# Altium project UCLA-DRS4-2.1.PrjPCB (part 6 of 10)

## Sheet CLK_PWR.SchDoc: My title
size A3; Organization: University of California; Address1: 475 Portola Plaza; Address2: Los Angeles, CA 90095; DocumentNumber: 12; Revision: R01; SheetNumber: 12; SheetTotal: 35
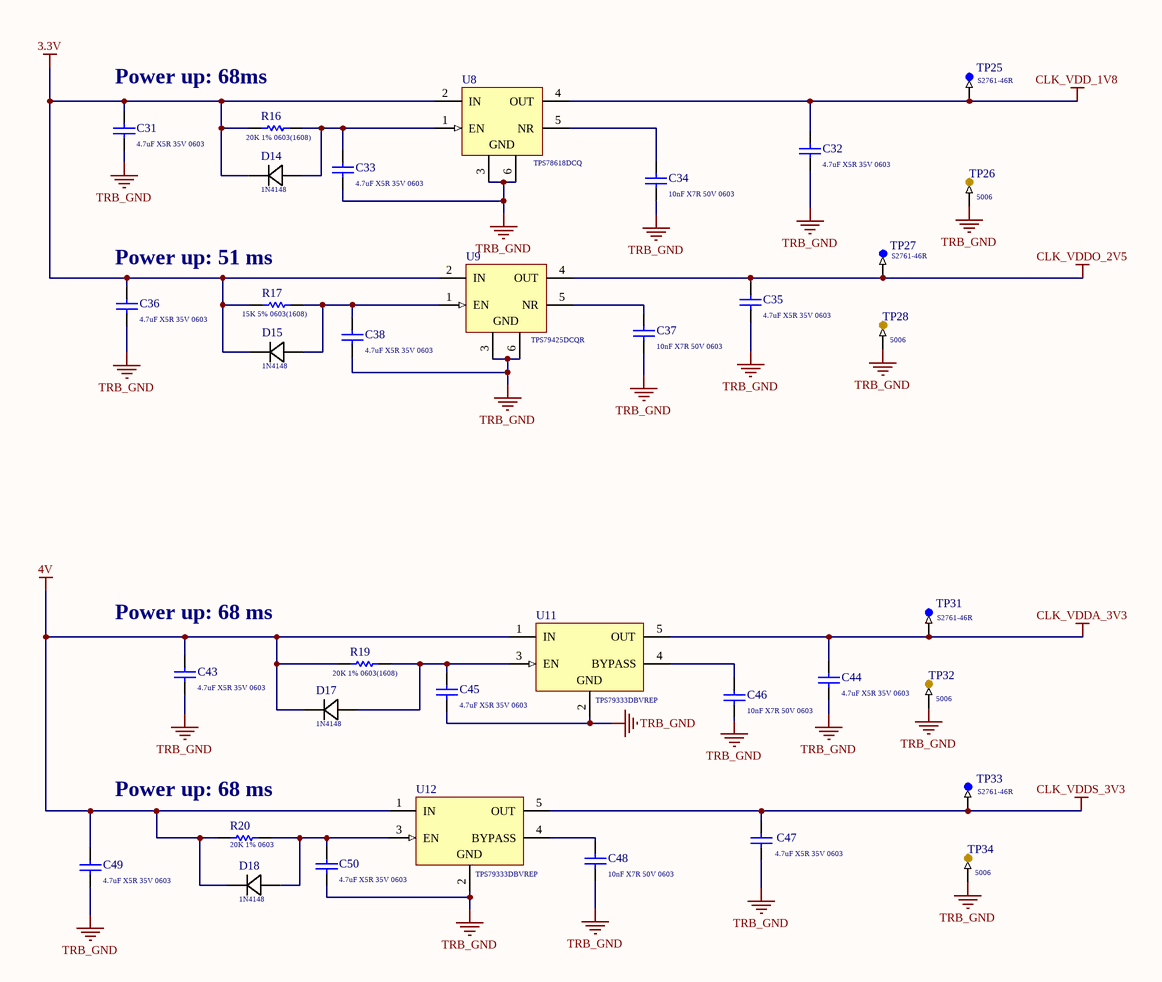
[diagram p14: CLK_PWR.SchDoc]

### Parts
C31  Capacitance: 4.7uF X5R 35V 0603  [Cap_Murata_ZRB18AR6YA475ME05L_4.7uF]  (hidden comment: Cap_Murata_ZRB18AR6YA475ME05L_4.7uF)
C32  Capacitance: 4.7uF X5R 35V 0603  [Cap_Murata_ZRB18AR6YA475ME05L_4.7uF]  (hidden comment: Cap_Murata_ZRB18AR6YA475ME05L_4.7uF)
C33  Capacitance: 4.7uF X5R 35V 0603  [Cap_Murata_ZRB18AR6YA475ME05L_4.7uF]  (hidden comment: Cap_Murata_ZRB18AR6YA475ME05L_4.7uF)
C34  Capacitance: 10nF X7R 50V 0603  [Kemet_C0603_0]  (hidden comment: Cap_Kemet_C0603C103J5RACTU_eec)
C35  Capacitance: 4.7uF X5R 35V 0603  [Cap_Murata_ZRB18AR6YA475ME05L_4.7uF]  (hidden comment: Cap_Murata_ZRB18AR6YA475ME05L_4.7uF)
C36  Capacitance: 4.7uF X5R 35V 0603  [Cap_Murata_ZRB18AR6YA475ME05L_4.7uF]  (hidden comment: Cap_Murata_ZRB18AR6YA475ME05L_4.7uF)
C37  Capacitance: 10nF X7R 50V 0603  [Kemet_C0603_0]  (hidden comment: Cap_Kemet_C0603C103J5RACTU_eec)
C38  Capacitance: 4.7uF X5R 35V 0603  [Cap_Murata_ZRB18AR6YA475ME05L_4.7uF]  (hidden comment: Cap_Murata_ZRB18AR6YA475ME05L_4.7uF)
C43  Capacitance: 4.7uF X5R 35V 0603  [Cap_Murata_ZRB18AR6YA475ME05L_4.7uF]  (hidden comment: Cap_Murata_ZRB18AR6YA475ME05L_4.7uF)
C44  Capacitance: 4.7uF X5R 35V 0603  [Cap_Murata_ZRB18AR6YA475ME05L_4.7uF]  (hidden comment: Cap_Murata_ZRB18AR6YA475ME05L_4.7uF)
C45  Capacitance: 4.7uF X5R 35V 0603  [Cap_Murata_ZRB18AR6YA475ME05L_4.7uF]  (hidden comment: Cap_Murata_ZRB18AR6YA475ME05L_4.7uF)
C46  Capacitance: 10nF X7R 50V 0603  [Kemet_C0603_0]  (hidden comment: Cap_Kemet_C0603C103J5RACTU_eec)
C47  Capacitance: 4.7uF X5R 35V 0603  [Cap_Murata_ZRB18AR6YA475ME05L_4.7uF]  (hidden comment: Cap_Murata_ZRB18AR6YA475ME05L_4.7uF)
C48  Capacitance: 10nF X7R 50V 0603  [Kemet_C0603_0]  (hidden comment: Cap_Kemet_C0603C103J5RACTU_eec)
C49  Capacitance: 4.7uF X5R 35V 0603  [Cap_Murata_ZRB18AR6YA475ME05L_4.7uF]  (hidden comment: Cap_Murata_ZRB18AR6YA475ME05L_4.7uF)
C50  Capacitance: 4.7uF X5R 35V 0603  [Cap_Murata_ZRB18AR6YA475ME05L_4.7uF]  (hidden comment: Cap_Murata_ZRB18AR6YA475ME05L_4.7uF)
D14  Series: 1N4148  [Diode_ON_Semiconductor_1N4148WT_300mA]  (hidden comment: Diode_ON_Semiconductor_1N4148WT_300mA)
D15  Series: 1N4148  [Diode_ON_Semiconductor_1N4148WT_300mA]  (hidden comment: Diode_ON_Semiconductor_1N4148WT_300mA)
D17  Series: 1N4148  [Diode_ON_Semiconductor_1N4148WT_300mA]  (hidden comment: Diode_ON_Semiconductor_1N4148WT_300mA)
D18  Series: 1N4148  [Diode_ON_Semiconductor_1N4148WT_300mA]  (hidden comment: Diode_ON_Semiconductor_1N4148WT_300mA)
R16  20K 1% 0603(1608)  [RESC0603(1608)_M]
R17  15K 5% 0603(1608)  [RESC0603(1608)_M]
R19  20K 1% 0603(1608)  [RESC0603(1608)_M]
R20  20K 1% 0603  [RESC0603(1608)_M]
TP25  Series: S2761-46R  [TP_Harwin_S2761_46R]  (hidden comment: TP_Harwin_S2761_46R)
TP26  Series: 5006  [TP_Keystone_Electronics_5006]  (hidden comment: TP_Keystone_Electronics_5006)
TP27  Series: S2761-46R  [TP_Harwin_S2761_46R]  (hidden comment: TP_Harwin_S2761_46R)
TP28  Series: 5006  [TP_Keystone_Electronics_5006]  (hidden comment: TP_Keystone_Electronics_5006)
TP31  Series: S2761-46R  [TP_Harwin_S2761_46R]  (hidden comment: TP_Harwin_S2761_46R)
TP32  Series: 5006  [TP_Keystone_Electronics_5006]  (hidden comment: TP_Keystone_Electronics_5006)
TP33  Series: S2761-46R  [TP_Harwin_S2761_46R]  (hidden comment: TP_Harwin_S2761_46R)
TP34  Series: 5006  [TP_Keystone_Electronics_5006]  (hidden comment: TP_Keystone_Electronics_5006)
U8  TPS78618DCQ  [DCQ0006A_L]
U9  TPS79425DCQR  [DCQ0006A_L]
U11  TPS79333DBVREP  [DBV0005A_M]
U12  TPS79333DBVREP  [DBV0005A_M]

### Nets
3.3V: C31.2 C36.2 D14.1 D15.1 R16.1 R17.1 U8.2(IN) U9.2(IN)
4V: C43.2 C49.2 D17.1 D18.1 R19.1 R20.2 U11.1(IN) U12.1(IN)
CLK_VDD_1V8: C32.2 TP25.1 U8.4(OUT)
CLK_VDDA_3V3: C44.2 TP31.1 U11.5(OUT)
CLK_VDDO_2V5: C35.2 TP27.1 U9.4(OUT)
CLK_VDDS_3V3: C47.2 TP33.1 U12.5(OUT)
TRB_GND: C31.1 C32.1 C33.1 C34.2 C35.1 C36.1 C37.2 C38.1 C43.1 C44.1 C45.1 C46.2 C47.1 C48.2 C49.1 C50.1 TP26.1 TP28.1 TP32.1 TP34.1 U8.3(GND) U8.6(GND) U9.3(GND) U9.6(GND) U11.2(GND) U12.2(GND)
NetC33_2: C33.2 D14.2 R16.2 U8.1(EN)
NetC34_1: C34.1 U8.5(NR)
NetC37_1: C37.1 U9.5(NR)
NetC38_2: C38.2 D15.2 R17.2 U9.1(EN)
NetC45_2: C45.2 D17.2 R19.2 U11.3(EN)
NetC46_1: C46.1 U11.4(BYPASS)
NetC48_1: C48.1 U12.4(BYPASS)
NetC50_2: C50.2 D18.2 R20.1 U12.3(EN)

### Notes on the sheet
- Power up: 68ms
- Power up: 51 ms
- (near C43) Power up: 68 ms
- (near R20) Power up: 68 ms
- 475 Portola Plaza
- GAPS TOF
- igarcia91@g.ucla.edu
- Los Angeles, CA
- 310-825-0344
- Size:
- Date:
- Letter
- Revision:
- Time:
- Sheet
- of
- andrew.peck@cern.ch
- spq@ucla.edu
- File:

### Library data of the parts
C31-C33 C35 C36 C38 C43-C45 C47 C49 C50 = Cap_Murata_ZRB18AR6YA475ME05L_4.7uF: CAP CER 4.7uF 35V X5R 0603; Supplier 1: Mouser; Supplier Part Number 1: 81-ZRB18AR6YA475ME5L
C34 C37 C46 C48 = Cap_Kemet_C0603C103J5RACTU_eec: as C94 on sheet CLK_SYNTH; Part Number: C0603C103J5RACTU; helpURL: https://upverter.com/upn/revision/8a8d0c297e33ac74/; ComponentLink2Description: Datasheet; Temperature: -55°C to +125°C; Package: C0603; Supplier 2: Mouser; Price: 0.0184203126773; Supplier 1: Digi-Key; ComponentLink1URL: https://upverter.com/upn/revision/8a8d0c297e33ac74/; Supplier Part Number 2: 80-C0603C103J5R; Supplier Part Number 1: 399-1092-1-ND; Value: 10nF; ComponentLink1Description: Upverter; ComponentLink2URL: https://content.kemet.com/datasheets/KEM_C1002_X7R_SMD.pdf; RoHS: TRUE; Mouser Part Number: 80-C0603C103J5R; Temperature Range High: +125°C; Digikey Description: CAP CER 10000PF 50V X7R 0603; Digikey Part Number: 399-1092-1-ND; Lead Free: yes; Temperature Range Low: -55°C; Voltage: 50V
D14 D15 D17 D18 = Diode_ON_Semiconductor_1N4148WT_300mA: Diodes - General Purpose, Power, Switching SINGLE JUNC. 75V 4.0NS COMP; Supplier 1: Mouser; Supplier Part Number 1: 512-1N4148WT
R16 = CMP-1012-00655-1: 20K 0.1W 1% 0603 (1608 Metric)  SMD; Value: 20000.00 Ohm; Case-Metric: 1608; Case-EIA: 0603; Power: 0.1 W; Technology: SMT; Tolerance: 1 %
R17 = CMP-1012-00102-1: 15K 0.1W 5% 0603 (1608 Metric)  SMD; Value: 15000.00 Ohm; Case-EIA: 0603; Case-Metric: 1608; Tolerance: 5 %; Technology: SMT; Power: 0.1 W
R19 R20 = CMP-1012-00655-1: 20K 0.1W 1% 0603 (1608 Metric)  SMD; Case-Metric: 1608; Case-EIA: 0603; Value: 20000.00 Ohm; Technology: SMT; Power: 0.1 W; Tolerance: 1 %
TP25 TP27 TP31 TP33 = TP_Harwin_S2761_46R: Circuit Board Hardware - PCB SMT Mini Test Terminal, Reel; Supplier 1: Newark; Supplier Part Number 1: 76Y5391
TP26 TP28 TP32 TP34 = TP_Keystone_Electronics_5006: Circuit Board Hardware - PCB TEST POINT BLK .063; Supplier 1: Mouser; Supplier Part Number 1: 534-5006
U8 = CMP-0395-00376-2: Single Output High PSRR LDO, 1.5 A, Fixed 1.8 V Output, 2.7 to 5.5 V Input, 6-pin SOT-223 (DCQ), -40 to 125 degC, Green (RoHS & no Sb/Br); Manufacturer: Texas Instruments; Accuracy(%): 3; Fixed Output Options(V): 1.8; Vin(Min)(V): 2.7; SubFamily: Single Channel LDO; Vdo(Typ)(mV): 390; Vin(Max)(V): 5.5; Iout(Max)(A): 1.5; Iq(Typ)(mA): 0.2; Vout Adj(Min)(V): 1.8; ComponentLink3Description: Package Specification; PackageReference: DCQ0006A; ComponentLink3URL: http://www.ti.com/litv/pdf/mpds098c; ComponentLink1Description: Manufacturer URL; DatasheetVersion: SLVS389L; PackageDescription: 6-Pin Plastic Small Outline, Body 3.5 x 6.5 mm, Pitch 1.27 mm; Vout Adj(Max)(V): 1.8; ComponentLink1URL: http://www.ti.com/; Eco-Plan: Green (RoHS & no Sb/Br); Mounting Technology: Surface Mount; PartNumber: TPS78618DCQ; PackageVersion: 4202109/D; ComponentLink2URL: http://www.ti.com/general/docs/lit/getliterature.tsp?genericPartNumber=TPS78618&fileType=pdf; ComponentLink2Description: Datasheet
U9 = CMP-0394-00936-2: Single Output High PSRR LDO, 250 mA, Fixed 2.5 V Output, 2.7 to 5.5 V Input, 6-pin SOT-223 (DCQ), -40 to 85 degC, Green (RoHS & no Sb/Br); Manufacturer: Texas Instruments; SubFamily: Single Channel LDO; Iout(Max)(A): 0.25; Vin(Max)(V): 5.5; Vin(Min)(V): 2.7; Fixed Output Options(V): 2.5; Vdo(Typ)(mV): 155; Iq(Typ)(mA): 0.26; Accuracy(%): 3; ComponentLink3Description: Package Specification; Mounting Technology: Surface Mount; ComponentLink1URL: http://www.ti.com/; PackageVersion: 4202109/D; ComponentLink2URL: http://www.ti.com/general/docs/lit/getliterature.tsp?genericPartNumber=TPS79425&fileType=pdf; DatasheetVersion: SLVS349E; Eco-Plan: Green (RoHS & no Sb/Br); PackageReference: DCQ0006A; PackageDescription: 6-Pin Plastic Small Outline, Body 3.5 x 6.5 mm, Pitch 1.27 mm; Vout Adj(Min)(V): 2.5; ComponentLink1Description: Manufacturer URL; Vout Adj(Max)(V): 2.5; ComponentLink3URL: http://www.ti.com/litv/pdf/mpds098c; ComponentLink2Description: Datasheet; PartNumber: TPS79425DCQR
U11 U12 = CMP-0394-00316-2: Single Output Fast RF LDO, 200 mA, Fixed 3.3 V Output, 2.7 to 5.5 V Input, 5-pin SOT-23 (DBV), -40 to 125 degC, Green (RoHS & no Sb/Br); Manufacturer: Texas Instruments; Accuracy(%): 2; SubFamily: Single Channel LDO; Vin(Max)(V): 5.5; Fixed Output Options(V): 3.3; Vdo(Typ)(mV): 102; Iout(Max)(A): 0.2; Rating: HiRel Enhanced Product; Vin(Min)(V): 2.7; DatasheetVersion: SGLS163B; PackageVersion: 4073253-4/K; Code_JEDEC: MO-178; PackageDescription: 5-Pin Plastic Small Outline, Body 1.60 Ãƒâ€” 2.90 mm, Pitch 0.95 mm; ComponentLink1Description: Manufacturer URL; ComponentLink1URL: http://www.ti.com/; ComponentLink2Description: Datasheet; ComponentLink2URL: http://www.ti.com/general/docs/lit/getliterature.tsp?genericPartNumber=TPS79333-EP&fileType=pdf; ComponentLink3URL: http://www.ti.com/litv/pdf/mpds018i; Mounting Technology: Surface Mount; PartNumber: TPS79333DBVREP; Vout Adj(Min)(V): 3.3; PackageReference: DBV0005A; Iq(Typ)(mA): 0.2; Vout Adj(Max)(V): 3.3; Eco-Plan: Green (RoHS & no Sb/Br); ComponentLink3Description: Package Specification

## Sheet 2V5_DRS4_SUPPLY.SchDoc: My title
size A3; Organization: University of California; Address1: 475 Portola Plaza; Address2: Los Angeles, CA 90095; DocumentNumber: 8; Revision: R01; SheetNumber: 8; SheetTotal: 35
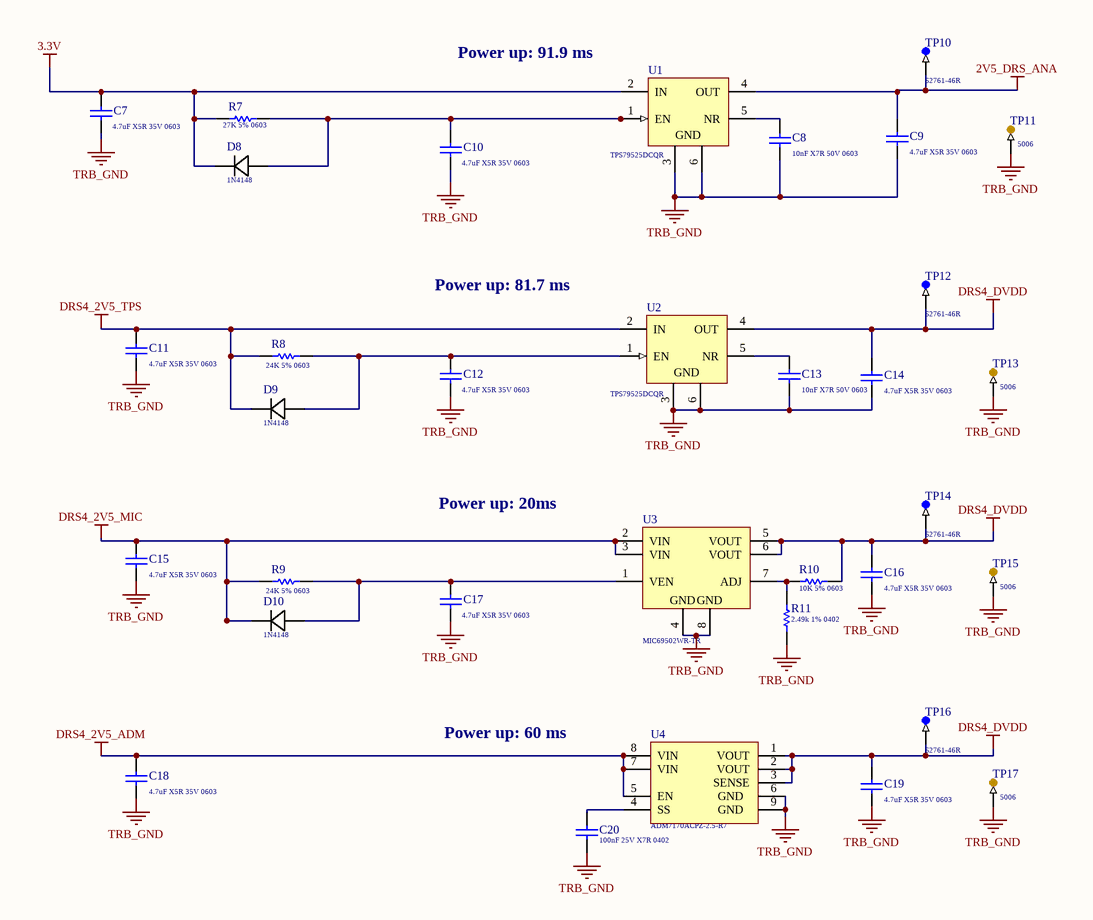
[diagram p15: 2V5_DRS4_SUPPLY.SchDoc]

### Parts
C7  Capacitance: 4.7uF X5R 35V 0603  [Cap_Murata_ZRB18AR6YA475ME05L_4.7uF]  (hidden comment: Cap_Murata_ZRB18AR6YA475ME05L_4.7uF)
C8  Capacitance: 10nF X7R 50V 0603  [Kemet_C0603_0]  (hidden comment: Cap_Kemet_C0603C103J5RACTU_eec)
C9  Capacitance: 4.7uF X5R 35V 0603  [Cap_Murata_ZRB18AR6YA475ME05L_4.7uF]  (hidden comment: Cap_Murata_ZRB18AR6YA475ME05L_4.7uF)
C10  Capacitance: 4.7uF X5R 35V 0603  [Cap_Murata_ZRB18AR6YA475ME05L_4.7uF]  (hidden comment: Cap_Murata_ZRB18AR6YA475ME05L_4.7uF)
C11  Capacitance: 4.7uF X5R 35V 0603  [Cap_Murata_ZRB18AR6YA475ME05L_4.7uF]  (hidden comment: Cap_Murata_ZRB18AR6YA475ME05L_4.7uF)
C12  Capacitance: 4.7uF X5R 35V 0603  [Cap_Murata_ZRB18AR6YA475ME05L_4.7uF]  (hidden comment: Cap_Murata_ZRB18AR6YA475ME05L_4.7uF)
C13  Capacitance: 10nF X7R 50V 0603  [Kemet_C0603_0]  (hidden comment: Cap_Kemet_C0603C103J5RACTU_eec)
C14  Capacitance: 4.7uF X5R 35V 0603  [Cap_Murata_ZRB18AR6YA475ME05L_4.7uF]  (hidden comment: Cap_Murata_ZRB18AR6YA475ME05L_4.7uF)
C15  Capacitance: 4.7uF X5R 35V 0603  [Cap_Murata_ZRB18AR6YA475ME05L_4.7uF]  (hidden comment: Cap_Murata_ZRB18AR6YA475ME05L_4.7uF)
C16  Capacitance: 4.7uF X5R 35V 0603  [Cap_Murata_ZRB18AR6YA475ME05L_4.7uF]  (hidden comment: Cap_Murata_ZRB18AR6YA475ME05L_4.7uF)
C17  Capacitance: 4.7uF X5R 35V 0603  [Cap_Murata_ZRB18AR6YA475ME05L_4.7uF]  (hidden comment: Cap_Murata_ZRB18AR6YA475ME05L_4.7uF)
C18  Capacitance: 4.7uF X5R 35V 0603  [Cap_Murata_ZRB18AR6YA475ME05L_4.7uF]  (hidden comment: Cap_Murata_ZRB18AR6YA475ME05L_4.7uF)
C19  Capacitance: 4.7uF X5R 35V 0603  [Cap_Murata_ZRB18AR6YA475ME05L_4.7uF]  (hidden comment: Cap_Murata_ZRB18AR6YA475ME05L_4.7uF)
C20  Capacitance: 100nF 25V X7R 0402  [Cap_Taiyo_Yuden_TMK105B7104KV-FR_100nF]  (hidden comment: Cap_Taiyo_Yuden_TMK105B7104KV-FR_100nF)
D8  Series: 1N4148  [Diode_ON_Semiconductor_1N4148WT_300mA]  (hidden comment: Diode_ON_Semiconductor_1N4148WT_300mA)
D9  Series: 1N4148  [Diode_ON_Semiconductor_1N4148WT_300mA]  (hidden comment: Diode_ON_Semiconductor_1N4148WT_300mA)
D10  Series: 1N4148  [Diode_ON_Semiconductor_1N4148WT_300mA]  (hidden comment: Diode_ON_Semiconductor_1N4148WT_300mA)
R7  27K 5% 0603  [RESC0603(1608)_L]
R8  24K 5% 0603  [RESC0603(1608)_L]
R9  24K 5% 0603  [RESC0603(1608)_L]
R10  10K 5% 0603  [RESC0603(1608)_L]
R11  Resistance: 2.49k 1% 0402  [Res_Yageo_RC0402FR-132K49L_2.48kOhm]  (hidden comment: Res_Yageo_RC0402FR-132K49L_2.48kOhm)
TP10  Series: S2761-46R  [TP_Harwin_S2761_46R]  (hidden comment: TP_Harwin_S2761_46R)
TP11  Series: 5006  [TP_Keystone_Electronics_5006]  (hidden comment: TP_Keystone_Electronics_5006)
TP12  Series: S2761-46R  [TP_Harwin_S2761_46R]  (hidden comment: TP_Harwin_S2761_46R)
TP13  Series: 5006  [TP_Keystone_Electronics_5006]  (hidden comment: TP_Keystone_Electronics_5006)
TP14  Series: S2761-46R  [TP_Harwin_S2761_46R]  (hidden comment: TP_Harwin_S2761_46R)
TP15  Series: 5006  [TP_Keystone_Electronics_5006]  (hidden comment: TP_Keystone_Electronics_5006)
TP16  Series: S2761-46R  [TP_Harwin_S2761_46R]  (hidden comment: TP_Harwin_S2761_46R)
TP17  Series: 5006  [TP_Keystone_Electronics_5006]  (hidden comment: TP_Keystone_Electronics_5006)
U1  TPS79525DCQR  [DCQ0006A_N]
U2  TPS79525DCQR  [DCQ0006A_N]
U3  Series: MIC69502WR-TR  [LDO_Microchip_MIC69502WR-TR_ADJ]  (hidden comment: LDO_Microchip_MIC69502WR-TR_ADJ)
U4  Series: ADM7170ACPZ-2.5-R7  [LDO_Analog_Devices_ADM7170ACPZ-2.5-R7_2.5V]  (hidden comment: LDO_Analog_Devices_ADM7170ACPZ-2.5-R7_2.5V)

### Nets
2V5_DRS_ANA: C9.2 TP10.1 U1.4(OUT)
3.3V: C7.2 D8.1 R7.1 U1.2(IN)
DRS4_2V5_ADM: C18.2 U4.5(EN) U4.7(VIN) U4.8(VIN)
DRS4_2V5_MIC: C15.2 D10.1 R9.1 U3.2(VIN) U3.3(VIN)
DRS4_2V5_TPS: C11.2 D9.1 R8.1 U2.2(IN)
DRS4_DVDD: C14.2 C16.2 C19.2 R10.2 TP12.1 TP14.1 TP16.1 U2.4(OUT) U3.5(VOUT) U3.6(VOUT) U4.1(VOUT) U4.2(VOUT) U4.3(SENSE)
TRB_GND: C7.1 C8.2 C9.1 C10.1 C11.1 C12.1 C13.2 C14.1 C15.1 C16.1 C17.1 C18.1 C19.1 C20.1 R11.1 TP11.1 TP13.1 TP15.1 TP17.1 U1.3(GND) U1.6(GND) U2.3(GND) U2.6(GND) U3.4(GND) U3.8(GND) U4.6(GND) U4.9(GND)
NetC8_1: C8.1 U1.5(NR)
NetC10_2: C10.2 D8.2 R7.2 U1.1(EN)
NetC12_2: C12.2 D9.2 R8.2 U2.1(EN)
NetC13_1: C13.1 U2.5(NR)
NetC17_2: C17.2 D10.2 R9.2 U3.1(VEN)
NetC20_2: C20.2 U4.4(SS)
NetR10_1: R10.1 R11.2 U3.7(ADJ)

### Notes on the sheet
- Power up: 91.9 ms
- Power up: 81.7 ms
- Power up: 20ms
- Power up: 60 ms
- 475 Portola Plaza
- GAPS TOF
- igarcia91@g.ucla.edu
- Los Angeles, CA
- 310-825-0344
- Size:
- Date:
- Letter
- Revision:
- Time:
- Sheet
- of
- andrew.peck@cern.ch
- spq@ucla.edu
- File:

### Library data of the parts
C7 C9-C12 C14-C19 = Cap_Murata_ZRB18AR6YA475ME05L_4.7uF: CAP CER 4.7uF 35V X5R 0603; Supplier 1: Mouser; Supplier Part Number 1: 81-ZRB18AR6YA475ME5L
C8 C13 = Cap_Kemet_C0603C103J5RACTU_eec: as C94 on sheet CLK_SYNTH; Part Number: C0603C103J5RACTU; helpURL: https://upverter.com/upn/revision/8a8d0c297e33ac74/; ComponentLink2Description: Datasheet; Temperature: -55°C to +125°C; Package: C0603; Supplier 2: Mouser; Price: 0.0184203126773; Supplier 1: Digi-Key; ComponentLink1URL: https://upverter.com/upn/revision/8a8d0c297e33ac74/; Supplier Part Number 2: 80-C0603C103J5R; Supplier Part Number 1: 399-1092-1-ND; Value: 10nF; ComponentLink1Description: Upverter; ComponentLink2URL: https://content.kemet.com/datasheets/KEM_C1002_X7R_SMD.pdf; RoHS: TRUE; Mouser Part Number: 80-C0603C103J5R; Temperature Range High: +125°C; Digikey Description: CAP CER 10000PF 50V X7R 0603; Digikey Part Number: 399-1092-1-ND; Lead Free: yes; Temperature Range Low: -55°C; Voltage: 50V
C20 = Cap_Taiyo_Yuden_TMK105B7104KV-FR_100nF: CAP CER 100nF 25V X7R 0402; Supplier 1: Mouser; Supplier Part Number 1: 963-TMK105B7104KV-FR
D8-D10 = Diode_ON_Semiconductor_1N4148WT_300mA: as D14 on sheet CLK_PWR; Supplier 1: Mouser; Supplier Part Number 1: 512-1N4148WT
R7 = CMP-1012-00108-1: as R18 on sheet MARS_MIO; Power: 0.1 W; Tolerance: 5 %; Technology: SMT
R8 R9 = CMP-1012-00107-1: 24K 0.1W 5% 0603 (1608 Metric)  SMD; Case-Metric: 1608; Case-EIA: 0603; Value: 24000.00 Ohm; Tolerance: 5 %; Technology: SMT; Power: 0.1 W
R10 = CMP-1012-00098-1: as R51 on sheet CLK_SYNTH; Technology: SMT; Tolerance: 5 %; Power: 0.1 W
R11 = Res_Yageo_RC0402FR-132K49L_2.48kOhm: Thick Film Resistors - SMD 2.49K ohm 1% 50V General Purpose; Supplier Part Number 1: 603-RC0402FR-132K49L; Supplier 1: Mouser
TP10 TP12 TP14 TP16 = TP_Harwin_S2761_46R: as TP25 on sheet CLK_PWR; Supplier 1: Newark; Supplier Part Number 1: 76Y5391
TP11 TP13 TP15 TP17 = TP_Keystone_Electronics_5006: as TP26 on sheet CLK_PWR; Supplier 1: Mouser; Supplier Part Number 1: 534-5006
U1 U2 = TPS79525DCQR: Single Output High PSRR LDO, 500 mA, Fixed 2.5 V Output, 2.7 to 5.5 V Input, 6-pin SOT-223 (DCQ), -40 to 125 degC, Green (RoHS & no Sb/Br); Manufacturer: Texas Instruments; Accuracy(%): 2; Iq(Typ)(mA): 0.26; Vin(Min)(V): 2.7; Vout Adj(Min)(V): 2.5; SubFamily: Single Channel LDO; Vin(Max)(V): 5.5; Rating: Catalog; Iout(Max)(A): 0.5; Vdo(Typ)(mV): 110; Eco-Plan: Green (RoHS & no Sb/Br); PartNumber: TPS79525DCQR; ComponentLink1Description: Manufacturer URL; ComponentLink2Description: Datasheet; DatasheetVersion: SLVS350H; ComponentLink3URL: http://www.ti.com/litv/pdf/mpds098c; Vout Adj(Max)(V): 2.5; ComponentLink1URL: http://www.ti.com/; Fixed Output Options(V): 2.5; ComponentLink2URL: http://www.ti.com/general/docs/lit/getliterature.tsp?genericPartNumber=TPS79525&fileType=pdf; PackageReference: DCQ0006A; ComponentLink3Description: Package Specification; PackageVersion: 4202109/D; Mounting Technology: Surface Mount; PackageDescription: 6-Pin Plastic Small Outline, Body 3.5 x 6.5 mm, Pitch 1.27 mm; Supplier 1: Mouser; Supplier 2: Digi-Key; Supplier 3: Arrow; Supplier Part Number 3: TPS79525DCQR; Supplier Part Number 2: 296-41778-6-ND; Supplier Part Number 1: 595-TPS79525DCQR
U3 = LDO_Microchip_MIC69502WR-TR_ADJ: LDO Voltage Regulators 5A Low VIN LDO Regulator with 0.5Vref; Supplier Part Number 1: 998-MIC69502WRTR; Supplier 1: Mouser
U4 = LDO_Analog_Devices_ADM7170ACPZ-2.5-R7_2.5V: LDO Voltage Regulators 0.5A Hi PSRR FT LDO 2.5V; Supplier Part Number 1: 584-ADM7170ACPZ2.5R7; Supplier 1: Mouser

## Sheet 4V_DIST.SchDoc: My title
size A3; Organization: University of California; Address1: 475 Portola Plaza; Address2: Los Angeles, CA 90095; DocumentNumber: 5; Revision: R01; SheetNumber: 5; SheetTotal: 35
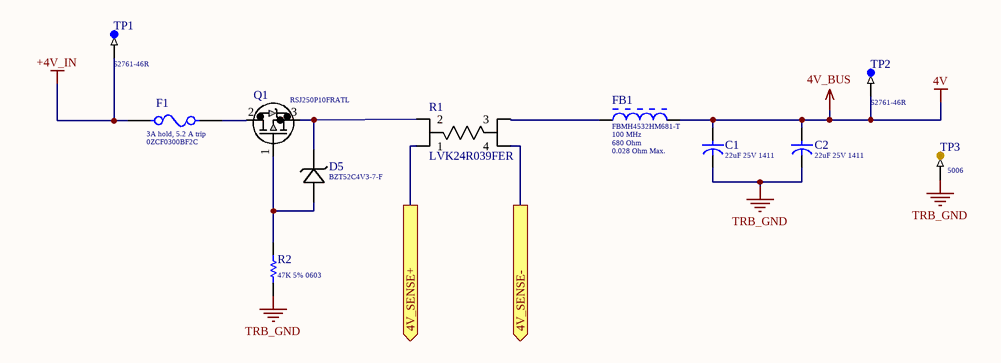
[diagram p16: 4V_DIST.SchDoc]

### Parts
C1  Capacitance: 22uF 25V 1411  [Cap_Kemet_T521B226M025ATE100_22uF]  (hidden comment: Cap_Kemet_T521B226M025ATE100_22uF)
C2  Capacitance: 22uF 25V 1411  [Cap_Kemet_T521B226M025ATE100_22uF]  (hidden comment: Cap_Kemet_T521B226M025ATE100_22uF)
D5  BZT52C4V3-7-F  [SOD123]
F1  3A hold, 5.2 A trip  [Bel_0ZCF_MFG]
FB1  Measuring Frequency: 100 MHz  Nominal Impedance: 680 Ohm  DC Resistance: 0.028 Ohm Max.  [TAYO-FBMH4532-2_V]  (hidden comment: FBMH4532HM681-T)
Q1  Series: RSJ250P10FRATL  [Mos_ROHM_RSJ250P10FRATL_25A]  (hidden comment: Mos_ROHM_RSJ250P10FRATL_25A)
R1  LVK24R039FER  [OH_LVK24_OHM]
R2  47K 5% 0603  [RESC0603(1608)_L]
TP1  Series: S2761-46R  [TP_Harwin_S2761_46R]  (hidden comment: TP_Harwin_S2761_46R)
TP2  Series: S2761-46R  [TP_Harwin_S2761_46R]  (hidden comment: TP_Harwin_S2761_46R)
TP3  Series: 5006  [TP_Keystone_Electronics_5006]  (hidden comment: TP_Keystone_Electronics_5006)

### Ports
4V_SENSE+ (out), 4V_SENSE- (out)

### Nets
4V: C1.1 C2.1 FB1.2 TP2.1  [also labelled 4V_BUS]
+4V_IN: F1.1 TP1.1
TRB_GND: C1.2 C2.2 R2.1 TP3.1
4V_SENSE_N: R1.4 ; port 4V_SENSE-
4V_SENSE_P: R1.1 ; port 4V_SENSE+
NetD5_1: D5.1 Q1.3(S) R1.2
NetD5_2: D5.2 Q1.1(G) R2.2
NetF1_2: F1.2 Q1.2(D)
NetFB1_1: FB1.1 R1.3

### Notes on the sheet
- 475 Portola Plaza
- GAPS TOF
- igarcia91@g.ucla.edu
- Los Angeles, CA
- 310-825-0344
- Size:
- Date:
- Letter
- Revision:
- Time:
- Sheet
- of
- andrew.peck@cern.ch
- spq@ucla.edu
- File:

### Library data of the parts
C1 C2 = Cap_Kemet_T521B226M025ATE100_22uF: Tantalum Capacitors - Polymer SMD 25V 22uF 1311 20% ESR=100mOhms; Supplier 1: Mouser; Supplier Part Number 1: 80-T521B226M25ATE100
D5 = BZT52C4V3-7-F: Zener Diodes 500mW 4.3V Zener AEC-Q101 Qualified; Vendor: Diodes Inc; Built_By: EMA_UL_Team; Type: DEV; C: Copyright (C) 2015 Accelerated Designs. All rights reserved; Manufacturer_Part_Number: BZT52C4V3-7-F; RefDes: RefDes; Supplier 1: Mouser; Supplier Part Number 1: 621-BZT52C4V3-F; Series: BZT52C4V3-7-F
F1 = 0ZCF0300BF2C: Resettable Fuses - PPTC 3A 24V PPTC 2920 SMD; Supplier 1: Mouser; Supplier 2: Digi-Key; Supplier Part Number 1: 530-0ZCF0300BF2C; Supplier Part Number 2: 507-2072-6-ND; Series: 0ZCF0300BF2C
FB1 = FBMH4532HM681-T: Chip Bead Inductor for Power Lines, 680 Ohm, 4 A, -40 to 125 degC, 2-Pin 4.5 x 3.2 x 3.5 mm SMD, RoHS, Taping; Manufacturer: Taiyo Yuden; Rated Current: 4 A Max.; Impedance Tolerance: +/- 25%; ComponentLink1Description: Manufacturer URL; ComponentLink2Description: Datasheet; DatasheetVersion: 09/2014; ComponentLink3URL: http://www.yuden.co.jp/productdata/catalog/en/chipbeads01_e.pdf; ComponentLink3Description: Package Specification; ComponentLink1URL: http://www.t-yuden.com/; Mounting Technology: Surface Mount; Packing: Taping; Temperature Range: -40 to 125 degC; PartNumber: FBMH4532HM681-T; PackageDescription: 2-Pin Surface Mount Device, Body 4.5 x 3.2 mm, Height 3.5 mm; ComponentLink2URL: http://www.yuden.co.jp/productdata/catalog/en/chipbeads01_e.pdf; RoHS: TRUE; Supplier 1: Digi-Key; Supplier Part Number 1: 587-1761-6-ND
Q1 = Mos_ROHM_RSJ250P10FRATL_25A: MOSFET Pch -100V Vds -25A 0.05Rds(on) 60Qg; Supplier 1: Mouser; Supplier Part Number 1: 755-RSJ250P10FRATL
R1 = LVK24R039FER: RES 0.039 OHM 1% 1W 2412; Vendor: Ohmite; Built_By: EMA_UL_Team; SourceLibrary: Ohmite_2014-12-31; Manufacturer_Part_Number: LVK24R039FER; Copyright: Copyright (C) 2018 Accelerated Designs. All rights reserved; RefDes: RefDes; Type: DEV
R2 = CMP-1012-00114-1: 47K 0.1W 5% 0603 (1608 Metric)  SMD; Case-EIA: 0603; Value: 47000.00 Ohm; Case-Metric: 1608; Tolerance: 5 %; Power: 0.1 W; Technology: SMT
TP1 TP2 = TP_Harwin_S2761_46R: as TP25 on sheet CLK_PWR; Supplier 1: Newark; Supplier Part Number 1: 76Y5391
TP3 = TP_Keystone_Electronics_5006: as TP26 on sheet CLK_PWR; Supplier 1: Mouser; Supplier Part Number 1: 534-5006

## Sheet -1V_DIST.SchDoc: My title
size A3; Organization: University of California; Address1: 475 Portola Plaza; Address2: Los Angeles, CA 90095; DocumentNumber: 11; Revision: R01; SheetNumber: 11; SheetTotal: 35
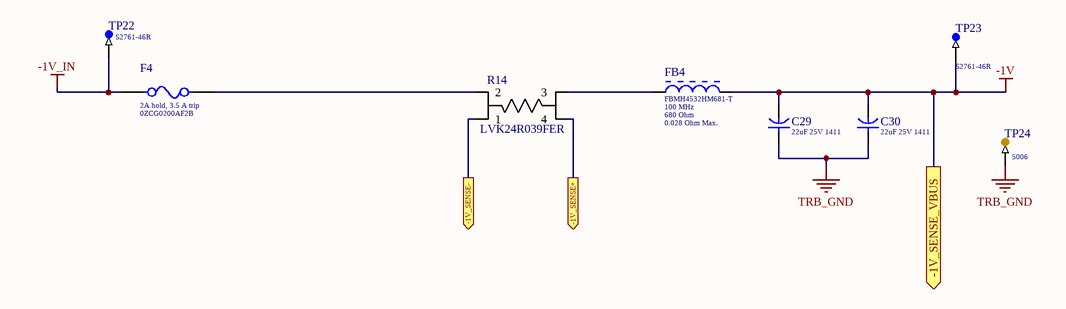
[diagram p17: -1V_DIST.SchDoc]

### Parts
C29  Capacitance: 22uF 25V 1411  [Cap_Kemet_T521B226M025ATE100_22uF]  (hidden comment: Cap_Kemet_T521B226M025ATE100_22uF)
C30  Capacitance: 22uF 25V 1411  [Cap_Kemet_T521B226M025ATE100_22uF]  (hidden comment: Cap_Kemet_T521B226M025ATE100_22uF)
F4  2A hold, 3.5 A trip  [Bel_0ZCG_MFG]
FB4  Measuring Frequency: 100 MHz  Nominal Impedance: 680 Ohm  DC Resistance: 0.028 Ohm Max.  [TAYO-FBMH4532-2_V]  (hidden comment: FBMH4532HM681-T)
R14  LVK24R039FER  [OH_LVK24_OHM]
TP22  Series: S2761-46R  [TP_Harwin_S2761_46R]  (hidden comment: TP_Harwin_S2761_46R)
TP23  Series: S2761-46R  [TP_Harwin_S2761_46R]  (hidden comment: TP_Harwin_S2761_46R)
TP24  Series: 5006  [TP_Keystone_Electronics_5006]  (hidden comment: TP_Keystone_Electronics_5006)

### Ports
-1V_SENSE+ (out), -1V_SENSE- (out), -1V_SENSE_VBUS (out)

### Nets
-1V: C29.2 C30.2 FB4.2 TP23.1 ; port -1V_SENSE_VBUS  [project net -1V_VBUS]
-1V_IN: F4.1 TP22.1
TRB_GND: C29.1 C30.1 TP24.1
-1V_SENSE_N: R14.1 ; port -1V_SENSE-
-1V_SENSE_P: R14.4 ; port -1V_SENSE+
NetF4_2: F4.2 R14.2
NetFB4_1: FB4.1 R14.3

### Notes on the sheet
- 475 Portola Plaza
- GAPS TOF
- igarcia91@g.ucla.edu
- Los Angeles, CA
- 310-825-0344
- Size:
- Date:
- Letter
- Revision:
- Time:
- Sheet
- of
- andrew.peck@cern.ch
- spq@ucla.edu
- File:

### Library data of the parts
C29 C30 = Cap_Kemet_T521B226M025ATE100_22uF: as C1 on sheet 4V_DIST; Supplier 1: Mouser; Supplier Part Number 1: 80-T521B226M25ATE100
F4 = 0ZCG0200AF2B: 2A hold, 3.5A trip; Supplier 1: Mouser; Supplier 2: Digi-Key; Supplier Part Number 2: 507-2074-6-ND; Supplier Part Number 1: 530-0ZCG0200AF2B; Series: 0ZCG0200AF2B
FB4 = FBMH4532HM681-T: as FB1 on sheet 4V_DIST; ComponentLink1Description: Manufacturer URL; ComponentLink2Description: Datasheet; DatasheetVersion: 09/2014; ComponentLink3URL: http://www.yuden.co.jp/productdata/catalog/en/chipbeads01_e.pdf; ComponentLink3Description: Package Specification; ComponentLink1URL: http://www.t-yuden.com/; Mounting Technology: Surface Mount; Packing: Taping; Temperature Range: -40 to 125 degC; PartNumber: FBMH4532HM681-T; PackageDescription: 2-Pin Surface Mount Device, Body 4.5 x 3.2 mm, Height 3.5 mm; ComponentLink2URL: http://www.yuden.co.jp/productdata/catalog/en/chipbeads01_e.pdf; RoHS: TRUE; Supplier 1: Digi-Key; Supplier Part Number 1: 587-1761-6-ND
R14 = LVK24R039FER: as R1 on sheet 4V_DIST; Manufacturer_Part_Number: LVK24R039FER; Copyright: Copyright (C) 2018 Accelerated Designs. All rights reserved; RefDes: RefDes; Type: DEV
TP22 TP23 = TP_Harwin_S2761_46R: as TP25 on sheet CLK_PWR; Supplier 1: Newark; Supplier Part Number 1: 76Y5391
TP24 = TP_Keystone_Electronics_5006: as TP26 on sheet CLK_PWR; Supplier 1: Mouser; Supplier Part Number 1: 534-5006